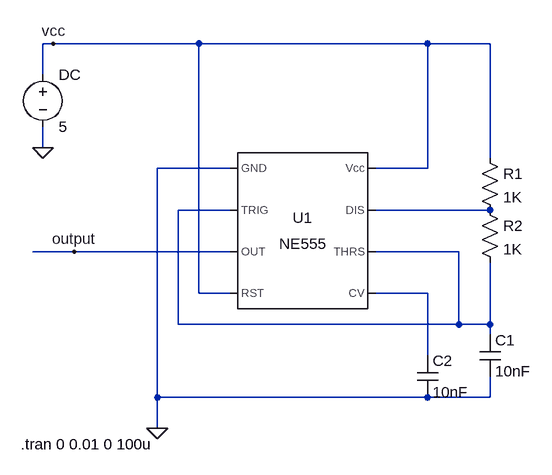
[diagram p0: schematic P1_2_66.asc]
P1_2_66.asc, the LTspice schematic file:
Version 4
SHEET 1 880 680
WIRE -160 -112 -176 -112
WIRE 64 -112 -160 -112
WIRE 416 -112 64 -112
WIRE 512 -112 416 -112
WIRE -176 -64 -176 -112
WIRE -176 48 -176 16
WIRE 512 64 512 -112
WIRE 112 80 0 80
WIRE 416 80 416 -112
WIRE 416 80 336 80
WIRE 112 144 32 144
WIRE 512 144 336 144
WIRE -128 208 -192 208
WIRE 112 208 -128 208
WIRE 464 208 336 208
WIRE 64 272 64 -112
WIRE 112 272 64 272
WIRE 416 272 336 272
WIRE 32 320 32 144
WIRE 464 320 464 208
WIRE 464 320 32 320
WIRE 512 320 512 224
WIRE 512 320 464 320
WIRE 512 336 512 320
WIRE 416 368 416 272
WIRE 0 432 0 80
WIRE 416 432 0 432
WIRE 512 432 512 400
WIRE 512 432 416 432
WIRE 0 480 0 432
FLAG -176 48 0
FLAG 0 480 0
FLAG -128 208 output
FLAG -160 -112 vcc
SYMBOL Misc\\NE555 224 176 R0
SYMATTR InstName U1
SYMBOL cap 496 336 R0
SYMATTR InstName C1
SYMATTR Value 10nF
SYMBOL res 496 48 R0
SYMATTR InstName R1
SYMATTR Value 1K
SYMBOL res 496 128 R0
SYMATTR InstName R2
SYMATTR Value 1K
SYMBOL voltage -176 -80 R0
WINDOW 123 0 0 Left 0
WINDOW 39 0 0 Left 0
SYMATTR InstName DC
SYMATTR Value 5
SYMBOL cap 400 368 R0
SYMATTR InstName C2
SYMATTR Value 10nF
TEXT -210 504 Left 2 !.tran 0 0.01 0 100u

The netlist it stands for:
* P1_2_66.asc
XU1 0 N001 output vcc N003 N001 N002 vcc NE555  ; pins GND TRIG OUT RST CV THRS DIS Vcc
C1 N001 0 10nF
R1 vcc N002 1K
R2 N002 N001 1K
V§DC vcc 0 5
C2 N003 0 10nF
.tran 0 0.01 0 100u
.lib NE555.sub
.backanno
.end